# Altium schematic sheet XTIDA-010086_ADC_Temp.SchDoc
size 558 x 431 mm; Date: Not shown in title block; ApprovedBy: Not shown in title block; CheckedBy: Not shown in title block; Author: Not shown in title block; CompanyName: Not shown in title block; Engineer: Not shown in title block; Organization: Not shown in title block; Address1: Not shown in title block; Address2: Not shown in title block; Address3: Not shown in title block; Address4: Not shown in title block; DocumentNumber: 2; Revision: Use project parameter SCH_Rev; SheetNumber: 5; SheetTotal: 8; PageSetup: Record=PageOptions|CenterHorizontal=True|CenterVertical=True|PrintScale=1.00|XCorrection=1.00|YCorrection=1.00|PrintKind=0|BorderSize=5000000|LeftOffset=0|BottomOffset=0|Orientation=2|PaperLength=1000|PaperWidth=1000|Scale=100|PaperSource=15|PrintQuality=600|MediaType=1|DitherType=10|PaperKind=Letter|PrintScaleMode=1; CurrentTime: Not shown in title block; CurrentDate: Not shown in title block; Time: Not shown in title block; DocumentFullPathAndName: Not shown in title block; DocumentName: Not shown in title block; ModifiedDate: Not shown in title block; ImagePath: Not shown in title block
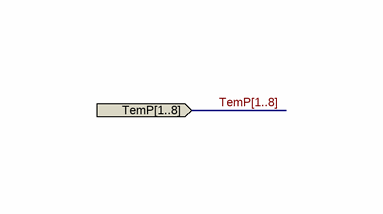
[diagram p0: XTIDA-010086_ADC_Temp.SchDoc, top left]
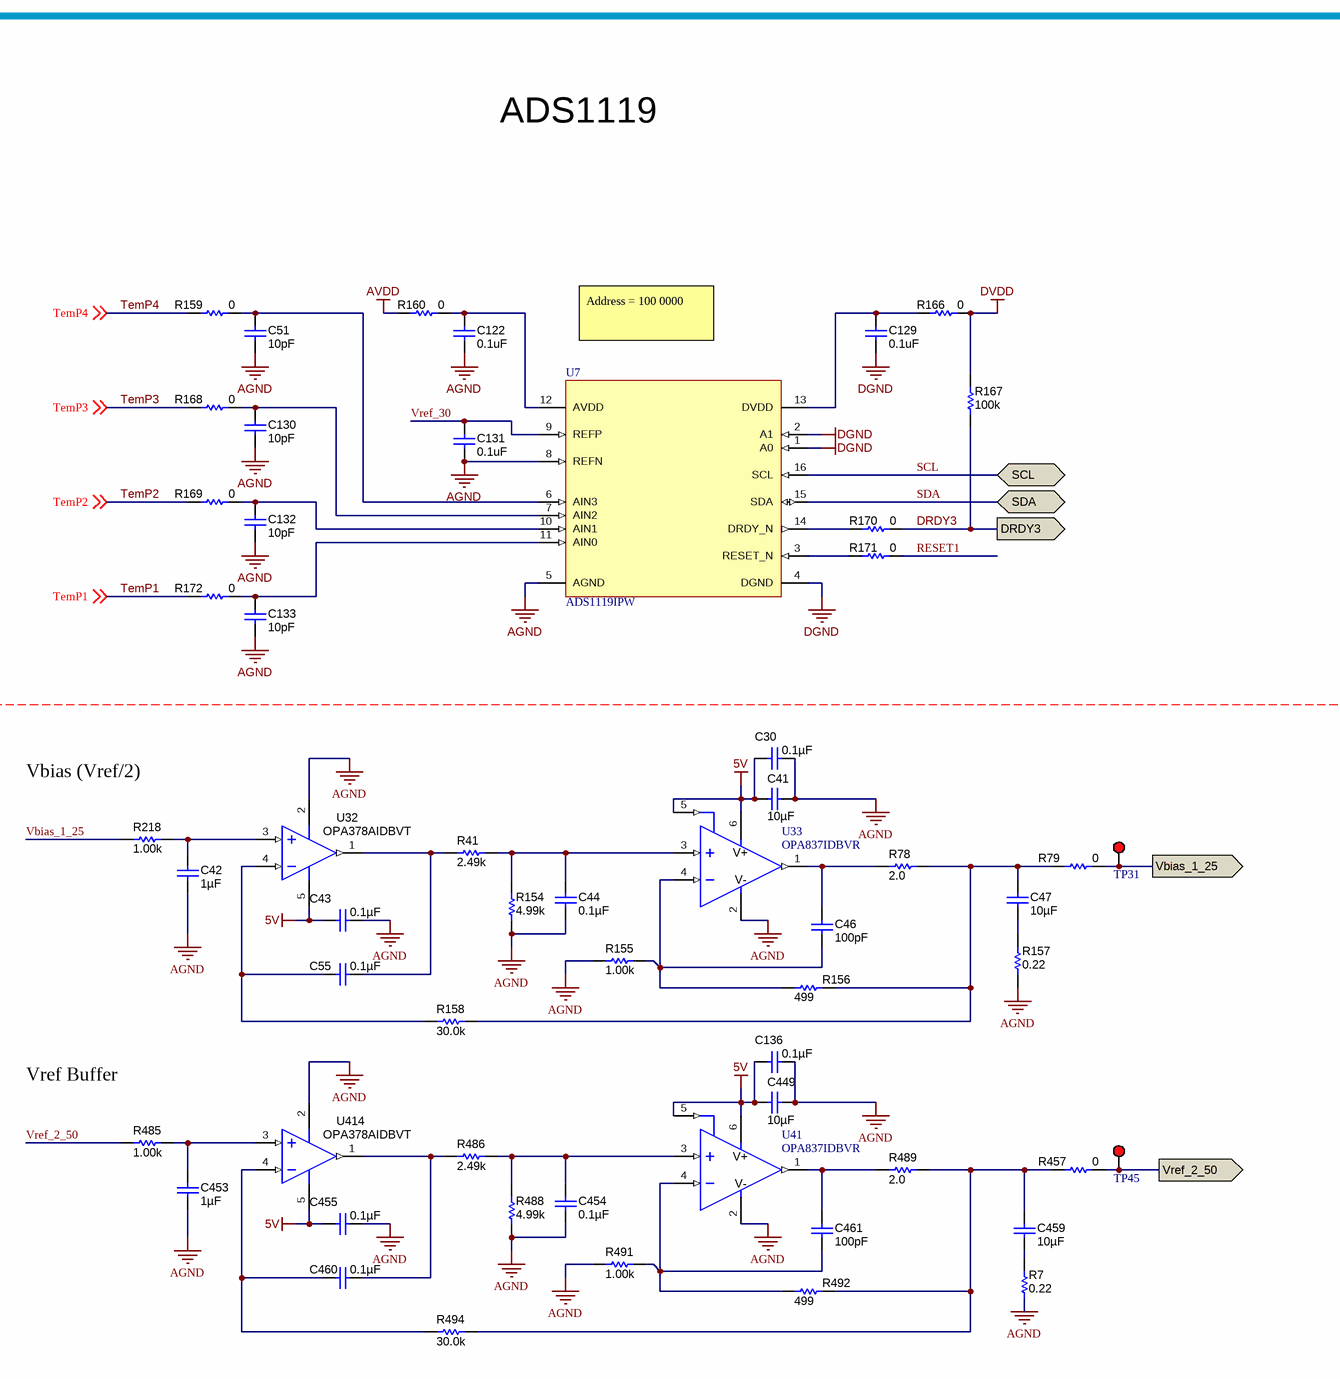
[diagram p1: XTIDA-010086_ADC_Temp.SchDoc, top right]
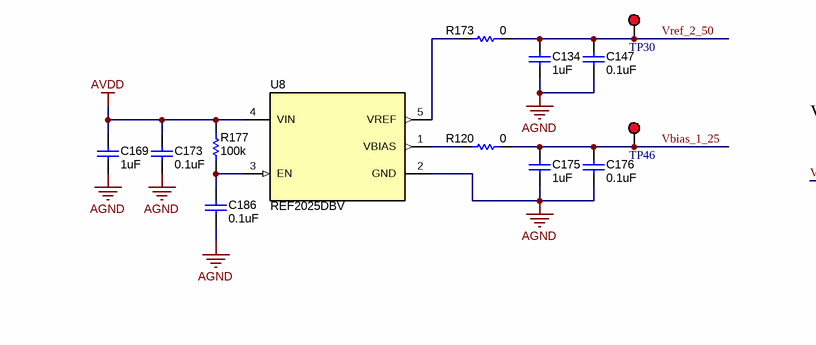
[diagram p2: XTIDA-010086_ADC_Temp.SchDoc, bottom left]
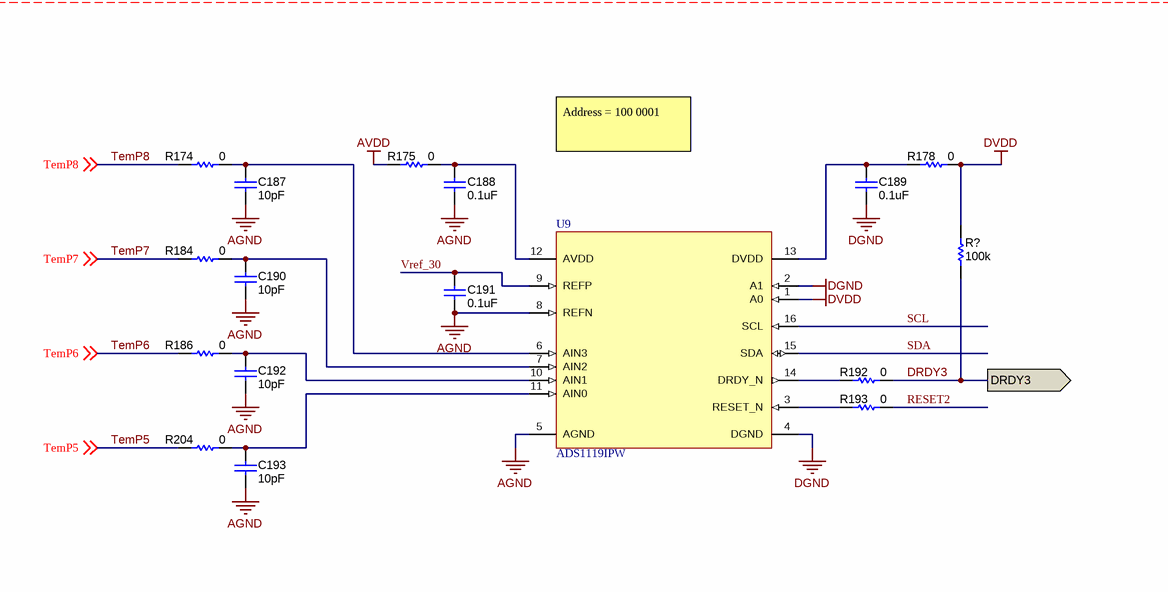
[diagram p3: XTIDA-010086_ADC_Temp.SchDoc, bottom right]

## Parts
C30  ValueDisplayed: 0.1µF  [0603]  (hidden comment: C0603C104J3RACTU)
C41  ValueDisplayed: 10µF  [0603L]  (hidden comment: ZRB18AD71A106KE01L)
C42  ValueDisplayed: 1µF  [0603]  (hidden comment: GRM188R71E105KA12D)
C43  ValueDisplayed: 0.1µF  [0603]  (hidden comment: C0603C104J3RACTU)
C44  ValueDisplayed: 0.1µF  [0603]  (hidden comment: C0603C104J3RACTU)
C46  ValueDisplayed: 100pF  [0603]  (hidden comment: 06035A101JAT2A)
C47  ValueDisplayed: 10µF  [0603L]  (hidden comment: ZRB18AD71A106KE01L)
C51  ValueDisplayed: 10pF  [0402]  (hidden comment: CGA2B2C0G1H100D050BA)
C55  ValueDisplayed: 0.1µF  [0603]  (hidden comment: C0603C104J3RACTU)
C122  ValueDisplayed: 0.1uF  [0603]  (hidden comment: Capacitor)
C129  ValueDisplayed: 0.1uF  [0603]  (hidden comment: Capacitor)
C130  ValueDisplayed: 10pF  [0402]  (hidden comment: CGA2B2C0G1H100D050BA)
C131  ValueDisplayed: 0.1uF  [0603]  (hidden comment: Capacitor)
C132  ValueDisplayed: 10pF  [0402]  (hidden comment: CGA2B2C0G1H100D050BA)
C133  ValueDisplayed: 10pF  [0402]  (hidden comment: CGA2B2C0G1H100D050BA)
C134  ValueDisplayed: 1uF  [0603]  (hidden comment: Capacitor)
C136  ValueDisplayed: 0.1µF  [0603]  (hidden comment: C0603C104J3RACTU)
C147  ValueDisplayed: 0.1uF  [0603]  (hidden comment: Capacitor)
C169  ValueDisplayed: 1uF  [0603]  (hidden comment: Capacitor)
C173  ValueDisplayed: 0.1uF  [0603]  (hidden comment: Capacitor)
C175  ValueDisplayed: 1uF  [0603]  (hidden comment: Capacitor)
C176  ValueDisplayed: 0.1uF  [0603]  (hidden comment: Capacitor)
C186  ValueDisplayed: 0.1uF  [0603]  (hidden comment: Capacitor)
C187  ValueDisplayed: 10pF  [0402]  (hidden comment: CGA2B2C0G1H100D050BA)
C188  ValueDisplayed: 0.1uF  [0603]  (hidden comment: Capacitor)
C189  ValueDisplayed: 0.1uF  [0603]  (hidden comment: Capacitor)
C190  ValueDisplayed: 10pF  [0402]  (hidden comment: CGA2B2C0G1H100D050BA)
C191  ValueDisplayed: 0.1uF  [0603]  (hidden comment: Capacitor)
C192  ValueDisplayed: 10pF  [0402]  (hidden comment: CGA2B2C0G1H100D050BA)
C193  ValueDisplayed: 10pF  [0402]  (hidden comment: CGA2B2C0G1H100D050BA)
C449  ValueDisplayed: 10µF  [0603L]  (hidden comment: ZRB18AD71A106KE01L)
C453  ValueDisplayed: 1µF  [0603]  (hidden comment: GRM188R71E105KA12D)
C454  ValueDisplayed: 0.1µF  [0603]  (hidden comment: C0603C104J3RACTU)
C455  ValueDisplayed: 0.1µF  [0603]  (hidden comment: C0603C104J3RACTU)
C459  ValueDisplayed: 10µF  [0603L]  (hidden comment: ZRB18AD71A106KE01L)
C460  ValueDisplayed: 0.1µF  [0603]  (hidden comment: C0603C104J3RACTU)
C461  ValueDisplayed: 100pF  [0603]  (hidden comment: 06035A101JAT2A)
R7  ValueDisplayed: 0.22  [0603]  (hidden comment: ERJ-3RQFR22V)
R41  ValueDisplayed: 2.49k  [0603]  (hidden comment: RG1608P-2491-B-T5)
R78  ValueDisplayed: 2.0  [0603]  (hidden comment: CRCW06032R00JNEA)
R79  ValueDisplayed: 0  [0402]  (hidden comment: ERJ-2GE0R00X)
R120  ValueDisplayed: 0  [0402]  (hidden comment: CRCW04020000Z0ED)
R154  ValueDisplayed: 4.99k  [0603]  (hidden comment: RG1608P-4991-B-T5)
R155  ValueDisplayed: 1.00k  [0603]  (hidden comment: RG1608P-102-B-T5)
R156  ValueDisplayed: 499  [0603]  (hidden comment: RG1608P-4990-B-T5)
R157  ValueDisplayed: 0.22  [0603]  (hidden comment: ERJ-3RQFR22V)
R158  ValueDisplayed: 30.0k  [0603]  (hidden comment: RG1608P-303-B-T5)
R159  ValueDisplayed: 0  [0402]  (hidden comment: CRCW04020000Z0ED)
R160  ValueDisplayed: 0  [0402]  (hidden comment: CRCW04020000Z0ED)
R166  ValueDisplayed: 0  [0402]  (hidden comment: CRCW04020000Z0ED)
R167  ValueDisplayed: 100k  [0603]  (hidden comment: RC0603FR-07100KL)
R168  ValueDisplayed: 0  [0402]  (hidden comment: CRCW04020000Z0ED)
R169  ValueDisplayed: 0  [0402]  (hidden comment: CRCW04020000Z0ED)
R170  ValueDisplayed: 0  [0402]  (hidden comment: CRCW04020000Z0ED)
R171  ValueDisplayed: 0  [0402]  (hidden comment: CRCW04020000Z0ED)
R172  ValueDisplayed: 0  [0402]  (hidden comment: CRCW04020000Z0ED)
R173  ValueDisplayed: 0  [0402]  (hidden comment: CRCW04020000Z0ED)
R174  ValueDisplayed: 0  [0402]  (hidden comment: CRCW04020000Z0ED)
R175  ValueDisplayed: 0  [0402]  (hidden comment: CRCW04020000Z0ED)
R177  ValueDisplayed: 100k  [0603]  (hidden comment: RC0603FR-07100KL)
R178  ValueDisplayed: 0  [0402]  (hidden comment: CRCW04020000Z0ED)
R184  ValueDisplayed: 0  [0402]  (hidden comment: CRCW04020000Z0ED)
R186  ValueDisplayed: 0  [0402]  (hidden comment: CRCW04020000Z0ED)
R192  ValueDisplayed: 0  [0402]  (hidden comment: CRCW04020000Z0ED)
R193  ValueDisplayed: 0  [0402]  (hidden comment: CRCW04020000Z0ED)
R204  ValueDisplayed: 0  [0402]  (hidden comment: CRCW04020000Z0ED)
R218  ValueDisplayed: 1.00k  [0603]  (hidden comment: RG1608P-102-B-T5)
R457  ValueDisplayed: 0  [0402]  (hidden comment: ERJ-2GE0R00X)
R485  ValueDisplayed: 1.00k  [0603]  (hidden comment: RG1608P-102-B-T5)
R486  ValueDisplayed: 2.49k  [0603]  (hidden comment: RG1608P-2491-B-T5)
R488  ValueDisplayed: 4.99k  [0603]  (hidden comment: RG1608P-4991-B-T5)
R489  ValueDisplayed: 2.0  [0603]  (hidden comment: CRCW06032R00JNEA)
R491  ValueDisplayed: 1.00k  [0603]  (hidden comment: RG1608P-102-B-T5)
R492  ValueDisplayed: 499  [0603]  (hidden comment: RG1608P-4990-B-T5)
R494  ValueDisplayed: 30.0k  [0603]  (hidden comment: RG1608P-303-B-T5)
R?  ValueDisplayed: 100k  [0603]  (hidden comment: RC0603FR-07100KL)
TP30  5000  [Keystone5000]  (value not drawn)
TP31  5000  [Keystone5000]  (value not drawn)
TP45  5000  [Keystone5000]  (value not drawn)
TP46  5000  [Keystone5000]  (value not drawn)
U7  ADS1119IPW  [PW0016A_M]
U8  REF2025DBV  [DBV0005A_N]
U9  ADS1119IPW  [PW0016A_M]
U32  OPA378AIDBVT  [DBV0005A_N]
U33  OPA837IDBVR  [DBV6_TEX]
U41  OPA837IDBVR  [DBV6_TEX]
U414  OPA378AIDBVT  [DBV0005A_N]

## Ports
DRDY3 (out), SCL (bidir), SDA (bidir), TemP[1..8] (in), Vbias_1_25 (out), Vref_2_50 (out)

## Nets
5V: C30.2 C41.2 C43.2 C136.2 C449.2 C455.2 U32.5(V+) U33.5(MODE) U33.6(V+) U41.5(MODE) U41.6(V+) U414.5(V+)
AGND: C30.1 C41.1 C42.2 C43.1 C44.2 C51.2 C122.2 C130.2 C131.2 C132.2 C133.2 C134.2 C136.1 C147.2 C169.2 C173.2 C175.2 C176.2 C186.2 C187.2 C188.2 C190.2 C191.2 C192.2 C193.2 C449.1 C453.2 C454.2 C455.1 R7.1 R154.1 R155.1 R157.1 R488.1 R491.1 U7.5(AGND) U7.8(REFN) U8.2(GND) U9.5(AGND) U9.8(REFN) U32.2(V-) U33.2(V-) U41.2(V-) U414.2(V-)
AVDD: C169.1 C173.1 R160.1 R175.1 R177.2 U8.4(VIN)
DGND: C129.2 C189.2 U7.1(A0) U7.2(A1) U7.4(DGND) U9.2(A1) U9.4(DGND)
DVDD: R166.2 R167.2 R178.2 R?.2 U9.1(A0)
DRDY3: R167.1 R170.2 R192.2 R?.1 ; port DRDY3
RESET1: R171.2
RESET2: R193.2
SCL: U7.16(SCL) U9.16(SCL) ; port SCL
SDA: U7.15(SDA) U9.15(SDA) ; port SDA
TemP1: R172.1 ; off-sheet TemP1
TemP2: R169.1 ; off-sheet TemP2
TemP3: R168.1 ; off-sheet TemP3
TemP4: R159.1 ; off-sheet TemP4
TemP5: R204.1 ; off-sheet TemP5
TemP6: R186.1 ; off-sheet TemP6
TemP7: R184.1 ; off-sheet TemP7
TemP8: R174.1 ; off-sheet TemP8
Vbias_1_25: C175.1 C176.1 R120.2 R218.1 TP46.1
Vbias_1_25: R79.2 TP31.1 ; port Vbias_1_25  [a separate net that carries the same name]
Vref_2_50: C134.1 C147.1 R173.2 R485.1 TP30.1
Vref_2_50: R457.2 TP45.1 ; port Vref_2_50  [a separate net that carries the same name]
Vref_30: C131.1 C191.1 U7.9(REFP) U9.9(REFP)
NetC42_1: C42.1 R218.2 U32.3(IN+)
NetC44_1: C44.1 R41.2 R154.2 U33.3(IN+)
NetC46_1: C46.1 R78.1 U33.1(OUT)
NetC46_2: C46.2 R155.2 R156.1 U33.4(IN-)
NetC47_1: C47.1 R78.2 R79.1 R156.2 R158.2
NetC47_2: C47.2 R157.2
NetC51_1: C51.1 R159.2 U7.6(AIN3)
NetC55_1: C55.1 R41.1 U32.1(OUT)
NetC55_2: C55.2 R158.1 U32.4(IN-)
NetC122_1: C122.1 R160.2 U7.12(AVDD)
NetC129_1: C129.1 R166.1 U7.13(DVDD)
NetC130_1: C130.1 R168.2 U7.7(AIN2)
NetC132_1: C132.1 R169.2 U7.10(AIN1)
NetC133_1: C133.1 R172.2 U7.11(AIN0)
NetC186_1: C186.1 R177.1 U8.3(EN)
NetC187_1: C187.1 R174.2 U9.6(AIN3)
NetC188_1: C188.1 R175.2 U9.12(AVDD)
NetC189_1: C189.1 R178.1 U9.13(DVDD)
NetC190_1: C190.1 R184.2 U9.7(AIN2)
NetC192_1: C192.1 R186.2 U9.10(AIN1)
NetC193_1: C193.1 R204.2 U9.11(AIN0)
NetC453_1: C453.1 R485.2 U414.3(IN+)
NetC454_1: C454.1 R486.2 R488.2 U41.3(IN+)
NetC459_1: C459.1 R457.1 R489.2 R492.2 R494.2
NetC459_2: C459.2 R7.2
NetC460_1: C460.1 R486.1 U414.1(OUT)
NetC460_2: C460.2 R494.1 U414.4(IN-)
NetC461_1: C461.1 R489.1 U41.1(OUT)
NetC461_2: C461.2 R491.2 R492.1 U41.4(IN-)
NetR120_1: R120.1 U8.1(VBIAS)
NetR170_1: R170.1 U7.14(DRDY_N)
NetR171_1: R171.1 U7.3(RESET_N)
NetR173_1: R173.1 U8.5(VREF)
NetR192_1: R192.1 U9.14(DRDY_N)
NetR193_1: R193.1 U9.3(RESET_N)

## Buses and harness runs
bus TemP[1..8] = port TemP[1..8]

## Layout directives
net class Vref: 5V, AGND, AVDD, Vbias_1_25, Vref_2_50

## Notes on the sheet
- ADS1119
- Address = 100 0000
- Vbias (Vref/2)
- Vref Buffer
- Address = 100 0001
- Drawn By:
- SVN Rev:
- Number:
- TID #:
- Orderable:
- Rev:
- Sheet Title:
- File:
- Project Title:
- Designed for:
- Assembly Variant:
- Mod. Date:
- Sheet:
- Size:
- of
- C
- http://www.ti.com
- Texas Instruments and/or its licensors do not warrant the accuracy or completeness of this specification or any information contained therein. Texas Instruments and/or its licensors do not warrant that this design will meet the specifications, will be suitable for your application or fit for any particular purpose, or will operate in an implementation. Texas Instruments and/or its licensors do not warrant that the design is production worthy. You should completely validate and test your design implementation to confirm the system functionality for your application.
- Engineer:
- Contact:
- © Texas Instruments

## Library data of the parts
C30 C43 C44 C55 C136 C454 C455 C460 = C0603C104J3RACTU: CAP, CERM, 0.1 µF, 25 V, +/- 5%, X7R, 0603; Manufacturer: Kemet; Polarized: N; CompType: Capacitor; Value: 0.1uF; U/M: EA; Cap_F: 0.0000001; Tolerance_%: 5; Value1: Unknown; VDC_V: 25; Value2: 25V; TaMin_C: -55; TaMax_C: 125; SymbolVersion: 2008-07-09; PartNumber: C0603C104J3RACTU; PackageReference: 0603; RoHS: Y; MountType: SMT; Technology: Ceramic; TempCo: X7R; Cap_Case: 0603; Published: 2008-06-19; Publisher: Texas Instruments; LatestRevisionDate: 2015-07-09; ComponentLink1Description: Datasheet link; ComponentLink1URL: http://www.kemet.com/kemet/web/homepage/kechome.nsf/vapubfiles/F3102_Y5V.pdf/$file/F3102_Y5V.pdf; Supplier 1: Digi-Key; Supplier Part Number 1: 399-1282-1-ND; Supplier 2: Mouser; Supplier Part Number 2: 80-C0603C104J3R; Supplier 3: Farnell; Supplier Part Number 3: 1650833
C41 C47 C449 C459 = ZRB18AD71A106KE01L: CAP, CERM, 10 µF, 10 V, +/- 10%, X7T, 0603; Manufacturer: MuRata; Polarized: N; CompType: Capacitor; Value: 10uF; U/M: EA; Cap_F: 0.00001; Tolerance_%: 10; Value1: Unknown; Value2: 10V; TaMin_C: -55; TaMax_C: 125; Cap_Case: 0603; AEC Category: Q200; SymbolVersion: 2008-07-09; PartNumber: ZRB18AD71A106KE01L; PackageReference: 0603; RoHS: Y; VDC_V: 10; MountType: SMT; Technology: Ceramic; TempCo: X7T; Published: 2008-06-19; Publisher: Texas Instruments; LatestRevisionDate: 2015-11-13; ComponentLink1Description: Datasheet link; ComponentLink1URL: http://search.murata.co.jp/Ceramy/image/img/A01X/G101/ENG/ZRB18AD71A106KE01-01.pdf; Supplier 1: Digi-Key; Supplier Part Number 1: 490-10987-1-ND; Supplier 2: Mouser; Supplier Part Number 2: 81-ZRB18AD71A106KE1L; AEC Qualified: N; AEC Grade: N/A
C42 C453 = GRM188R71E105KA12D: CAP, CERM, 1 µF, 25 V, +/- 10%, X7R, 0603; Manufacturer: MuRata; Polarized: N; CompType: Capacitor; Value: 1uF; U/M: EA; Cap_F: 0.000001; Tolerance_%: 10; Value1: Unknown; VDC_V: 25; Value2: 25V; TaMin_C: -55; TaMax_C: 125; SymbolVersion: 2008-07-09; PartNumber: GRM188R71E105KA12D; PackageReference: 0603; RoHS: Y; MountType: SMT; Technology: Ceramic; TempCo: X7R; Cap_Case: 0603; Published: 2008-06-19; Publisher: Texas Instruments; LatestRevisionDate: 2015-07-09; ComponentLink1Description: Datasheet link; ComponentLink1URL: http://search.murata.co.jp/Ceramy/PnsearchViewAction.do?HnOFG=ON&HnNFG=ON&SEL_CNT=50&sLang=en&sKey=GRM188R71E105KA12D&x=9&y=9&search=startwith; Supplier 1: Digi-Key; Supplier Part Number 1: 490-5307-1-ND; Supplier 2: Mouser; Supplier Part Number 2: 81-GRM188R71E105KA2D; Supplier 3: Farnell; Supplier Part Number 3: 1735540
C46 C461 = 06035A101JAT2A: CAP, CERM, 100 pF, 50 V, +/- 5%, C0G/NP0, 0603; Manufacturer: AVX; Polarized: N; CompType: Capacitor; Value: 100pF; U/M: EA; Cap_F: 0.0000000001; Tolerance_%: 5; ESR_ohm: 0.119; Value1: 0.119 ohm; VDC_V: 50; Value2: 50V; TaMin_C: -55; TaMax_C: 125; SizeArea_mm2: 1.28; SizeAreaWB_mm2: 4.68; SizeX_mm: 1.6; SizeY_mm: 0.8; SizeZ_mm: 1; AEC Category: Q200; SymbolVersion: 2008-07-09; PartNumber: 06035A101JAT2A; PackageReference: 0603; RoHS: Y; MountType: SMT; Technology: Ceramic; TempCo: C0G/NP0; Cap_Case: 0603; Published: 2008-06-19; Publisher: Texas Instruments; LatestRevisionDate: 2017-03-03; ComponentLink1Description: Datasheet link; ComponentLink1URL: http://datasheets.avx.com/C0GNP0-Dielectric.pdf; Supplier 1: Digi-Key; Supplier Part Number 1: 478-1175-1-ND; Supplier 2: Newark; Supplier Part Number 2: 96K4763; Supplier 3: Mouser; Supplier Part Number 3: 581-06035A101J; AEC Qualified: N; AEC Grade: N/A
C51 C130 C132 C133 C187 C190 C192 C193 = CGA2B2C0G1H100D050BA: CAP, CERM, 10 pF, 50 V,+/- 5%, C0G/NP0, AEC-Q200 Grade 1, 0402; Manufacturer: TDK; Polarized: N; CompType: Capacitor; Value: 10pF; U/M: EA; Cap_F: 0.00000000001; Tolerance_%: 5; VDC_V: 50; Value2: 50V; TaMin_C: -55; TaMax_C: 125; SizeArea_mm2: 0.5; SizeAreaWB_mm2: 3; SizeX_mm: 1; SizeZ_mm: 0.6; AEC Category: Q200; AEC Qualified: Y; SymbolVersion: 2008-07-09; PartNumber: CGA2B2C0G1H100D050BA; PackageReference: 0402; RoHS: Y; MountType: SMT; Technology: Ceramic; TempCo: C0G/NP0; Cap_Case: 0402; SizeY_mm: 0.5; Published: 2008-06-19; Publisher: Texas Instruments; LatestRevisionDate: 2017-06-22; ComponentLink1Description: Datasheet link; ComponentLink1URL: https://product.tdk.com/info/en/documents/chara_sheet/CGA2B2C0G1H100D050BA.pdf; Supplier 1: Digi-Key; Supplier Part Number 1: 445-5584-1-ND; Supplier 2: Newark; Supplier Part Number 2: 52W9563; Supplier 3: Mouser; Supplier Part Number 3: 810-CGA2B2C0G1H100D; AEC Grade: 1
C122 C129 C131 C147 C173 C176 C186 C188 C189 C191 = Capacitor: CAP, CERM, 0.1 uF, 25 V, +/- 5%, X7R, 0603; PartNumber: 06033C104JAT2A; Manufacturer: AVX; Polarized: N; Value: 0.1uF; U/M: EA; Cap_F: 100nF; ESR_ohm: 0.05; Value1: 0.05 ohm; VDC_V: 25V; TaMin_C: -55°C; TaMax_C: 125°C; AEC Category: Q200; SizeArea_mm2: 1.28; SizeAreaWB_mm2: 4.68; SizeX_mm: 1.6; SizeY_mm: 0.8; SizeZ_mm: 1; CompType: Capacitor; PackageReference: 0603; RoHS: Y; Tolerance_%: 5%; Value2: 25V; MountType: SMT; Technology: Ceramic; TempCo: X7R; Cap_Case: 0603; Published: 2008-06-19; Publisher: Texas Instruments; LatestRevisionDate: 2017-03-09; ComponentLink1Description: Datasheet link; ComponentLink1URL: http://datasheets.avx.com/X7RDielectric.pdf; Supplier 1: Digi-Key; Supplier Part Number 1: 478-3713-1-ND; Supplier 2: Mouser; Supplier Part Number 2: 581-06033C104JAT2A; Supplier 3: Farnell; Supplier Part Number 3: 1740614; AEC Qualified: N; AEC Grade: N/A
C134 C169 C175 = Capacitor: CAP, CERM, 1 uF, 25 V, +/- 10%, X7R, 0603; PartNumber: GRM188R71E105KA12D; Manufacturer: MuRata; Polarized: N; Value: 1uF; U/M: EA; Cap_F: 1µF; Value1: Unknown; VDC_V: 25V; TaMin_C: -55°C; TaMax_C: 125°C; AEC Category: Q200; SizeArea_mm2: 1.28; SizeAreaWB_mm2: 4.68; SizeX_mm: 1.6; SizeY_mm: 0.8; SizeZ_mm: 1; CompType: Capacitor; PackageReference: 0603; RoHS: Y; Tolerance_%: 10%; Value2: 25V; MountType: SMT; Technology: Ceramic; TempCo: X7R; Cap_Case: 0603; Published: 2008-06-19; Publisher: Texas Instruments; LatestRevisionDate: 2017-03-09; ComponentLink1Description: Datasheet link; ComponentLink1URL: http://search.murata.co.jp/Ceramy/PnsearchViewAction.do?HnOFG=ON&HnNFG=ON&SEL_CNT=50&sLang=en&sKey=GRM188R71E105KA12D&x=9&y=9&search=startwith; Supplier 1: Digi-Key; Supplier Part Number 1: 490-5307-1-ND; Supplier 2: Mouser; Supplier Part Number 2: 81-GRM188R71E105KA2D; Supplier 3: Farnell; Supplier Part Number 3: 1735540; AEC Qualified: ?
R7 R157 = ERJ-3RQFR22V: RES, 0.22, 1%, 0.1 W, 0603; Manufacturer: Panasonic; CompType: Resistor; Value: 0.22; Value_Code: R220; Tolerance_%: 1; Power_W: 0.1; Value2: 0.1W; TempCo: 300 ppm/C; SizeArea_mm2: 1.28; SizeX_mm: 1.6; SizeY_mm: 0.8; EIA_Code: E96; U/M: EA; AEC Category: Q200; SymbolVersion: 2009-05-29; PartNumber: ERJ-3RQFR22V; PackageReference: 0603; RoHS: Y; Res_ohm: 0.22; Value1: 1%; MountType: SMT; Technology: Thick Film; SizeZ_mm: 1; Published: 2008-06-26; Publisher: Texas Instruments; LatestRevisionDate: 2017-03-04; ComponentLink1Description: Datasheet link; ComponentLink1URL: http://www.panasonic.com/industrial/components/pdf/AOA0000CE3.pdf; Supplier 1: Digi-Key; Supplier Part Number 1: P.22AJCT-ND; Supplier 2: Newark; Supplier Part Number 2: 15R1425; Supplier 3: Mouser; Supplier Part Number 3: 667-ERJ-3RQFR22V; AEC Qualified: ?
R41 R486 = RG1608P-2491-B-T5: RES, 2.49 k, 0.1%, 0.1 W, 0603; Manufacturer: Susumu Co Ltd; CompType: Resistor; Value: 2.49k; Res_ohm: 2490; Value_Code: 2k49; Tolerance_%: 0.1; Value2: 0.1W; VDC_V: 75; TempCo: 25 ppm/C; EIA_Code: E192; U/M: EA; SymbolVersion: 2009-05-29; PartNumber: RG1608P-2491-B-T5; PackageReference: 0603; RoHS: Y; Value1: 0.1%; Power_W: 0.1; MountType: SMT; Technology: Metal Film; Published: 2008-06-26; Publisher: Texas Instruments; LatestRevisionDate: 2015-06-13; ComponentLink1Description: Datasheet link; ComponentLink1URL: http://www.susumu.co.jp/english/pdf/products-j01-01.pdf; Supplier 1: Digi-Key; Supplier Part Number 1: RG16P2.49KBCT-ND; Supplier 2: Mouser; Supplier Part Number 2: 754-RG1608P-2491-BT5; Supplier 3: Farnell; Supplier Part Number 3: 1797138
R78 R489 = CRCW06032R00JNEA: RES, 2.0, 5%, 0.1 W, 0603; Manufacturer: Vishay-Dale; CompType: Resistor; Value: 2.0; Res_ohm: 2; Value_Code: 2R00; Tolerance_%: 5; Power_W: 0.1; Value2: 0.1W; VDC_V: 75; TempCo: 200 ppm/C; SizeArea_mm2: 1.28; SizeX_mm: 1.6; SizeY_mm: 0.8; SizeZ_mm: 1; EIA_Code: E24; U/M: EA; AEC Category: Q200; SymbolVersion: 2009-05-29; PartNumber: CRCW06032R00JNEA; PackageReference: 0603; RoHS: Y; Value1: 5%; MountType: SMT; Technology: Thick Film; Published: 2008-06-26; Publisher: Texas Instruments; LatestRevisionDate: 2017-03-04; ComponentLink1Description: Datasheet link; ComponentLink1URL: http://www.vishay.com/docs/20035/dcrcwe3.pdf; Supplier 1: Digi-Key; Supplier Part Number 1: 541-2.0GCT-ND; Supplier 2: Mouser; Supplier Part Number 2: 71-CRCW0603J-2-E3; Supplier 3: Farnell; Supplier Part Number 3: 1889800; AEC Qualified: ?
R79 R457 = ERJ-2GE0R00X: RES, 0, 5%, 0.063 W, 0402; Manufacturer: Panasonic; CompType: Resistor; Value: 0; Value_Code: 0000; Tolerance_%: 5; Power_W: 0.063; Value2: 0.063W; VDC_V: 50; TempCo: 600 ppm/C; EIA_Code: E24; U/M: EA; AEC Category: Q200; SymbolVersion: 2009-05-29; PartNumber: ERJ-2GE0R00X; PackageReference: 0402; RoHS: Y; Res_ohm: 0; Value1: 5%; MountType: SMT; Technology: Thick Film; Published: 2008-06-26; Publisher: Texas Instruments; LatestRevisionDate: 2015-10-23; ComponentLink1Description: Datasheet link; ComponentLink1URL: http://www.panasonic.com/industrial/components/pdf/AOA0000CE1.pdf; Supplier 1: Digi-Key; Supplier Part Number 1: P0.0JCT-ND; Supplier 2: Mouser; Supplier Part Number 2: 667-ERJ-2GE0R00X; Supplier 3: Farnell; Supplier Part Number 3: 2059190; AEC Qualified: ?
R120 R159 R160 R166 R168-R175 R178 R184 R186 R192 R193 R204 = CRCW04020000Z0ED: RES, 0, 5%, 0.063 W, 0402; Manufacturer: Vishay-Dale; CompType: Resistor; Value: 0; Value_Code: 0000; Tolerance_%: 5; Power_W: 0.063; Value2: 0.063W; VDC_V: 50; TempCo: 200 ppm/C; SizeArea_mm2: 0.5; SizeX_mm: 1; SizeZ_mm: 0.6; EIA_Code: E24; U/M: EA; AEC Category: Q200; Green_Lifecycle: Active; Green_REACh: Passed; SymbolVersion: 2009-05-29; PartNumber: CRCW04020000Z0ED; PackageReference: 0402; RoHS: Y; Res_ohm: 0; Value1: 5%; MountType: SMT; Technology: Thick Film; SizeY_mm: 0.5; Published: 2008-06-26; Publisher: Texas Instruments; LatestRevisionDate: 2017-06-12; ComponentLink1Description: Datasheet link; ComponentLink1URL: http://www.vishay.com/docs/20035/dcrcwe3.pdf; Supplier 1: Digi-Key; Supplier Part Number 1: 541-0.0JCT-ND; Supplier 2: Newark; Supplier Part Number 2: 52K6543; Supplier 3: Mouser; Supplier Part Number 3: 71-CRCW0402-0-E3; AEC Qualified: ?; Green_EU RoHS: Passed with Exemption; Green_EU RoHS-2: Passed
R154 R488 = RG1608P-4991-B-T5: RES, 4.99 k, 0.1%, 0.1 W, 0603; Manufacturer: Susumu Co Ltd; CompType: Resistor; Value: 4.99k; Res_ohm: 4990; Value_Code: 4k99; Tolerance_%: 0.1; Value2: 0.1W; VDC_V: 75; TempCo: 25 ppm/C; EIA_Code: E192; U/M: EA; SymbolVersion: 2009-05-29; PartNumber: RG1608P-4991-B-T5; PackageReference: 0603; RoHS: Y; Value1: 0.1%; Power_W: 0.1; MountType: SMT; Technology: Metal Film; Published: 2008-06-26; Publisher: Texas Instruments; LatestRevisionDate: 2015-06-13; ComponentLink1Description: Datasheet link; ComponentLink1URL: http://www.susumu.co.jp/english/pdf/products-j01-01.pdf; Supplier 1: Digi-Key; Supplier Part Number 1: RG16P4.99KBCT-ND; Supplier 2: Mouser; Supplier Part Number 2: 754-RG1608P-4991-BT5
R155 R218 R485 R491 = RG1608P-102-B-T5: RES, 1.00 k, 0.1%, 0.1 W, 0603; Manufacturer: Susumu Co Ltd; CompType: Resistor; Value: 1.00k; Res_ohm: 1000; Value_Code: 1k00; Tolerance_%: 0.1; Value2: 0.1W; VDC_V: 75; TempCo: 25 ppm/C; EIA_Code: E192; U/M: EA; SymbolVersion: 2009-05-29; PartNumber: RG1608P-102-B-T5; PackageReference: 0603; RoHS: Y; Value1: 0.1%; Power_W: 0.1; MountType: SMT; Technology: Metal Film; Published: 2008-06-26; Publisher: Texas Instruments; LatestRevisionDate: 2015-06-13; ComponentLink1Description: Datasheet link; ComponentLink1URL: http://www.susumu.co.jp/english/pdf/products-j01-01.pdf; Supplier 1: Digi-Key; Supplier Part Number 1: RG16P1.0KBCT-ND; Supplier 2: Mouser; Supplier Part Number 2: 754-RG1608P-102-B-T5; Supplier 3: Farnell; Supplier Part Number 3: 1797076
R156 R492 = RG1608P-4990-B-T5: RES, 499, 0.1%, 0.1 W, 0603; Manufacturer: Susumu Co Ltd; CompType: Resistor; Value: 499; Value_Code: 499R; Tolerance_%: 0.1; Value2: 0.1W; VDC_V: 75; TempCo: 25 ppm/C; EIA_Code: E192; U/M: EA; SymbolVersion: 2009-05-29; PartNumber: RG1608P-4990-B-T5; PackageReference: 0603; RoHS: Y; Res_ohm: 499; Value1: 0.1%; Power_W: 0.1; MountType: SMT; Technology: Metal Film; Published: 2008-06-26; Publisher: Texas Instruments; LatestRevisionDate: 2015-06-13; ComponentLink1Description: Datasheet link; ComponentLink1URL: http://www.susumu.co.jp/english/pdf/products-j01-01.pdf; Supplier 1: Digi-Key; Supplier Part Number 1: RG16P499BCT-ND; Supplier 2: Mouser; Supplier Part Number 2: 754-RG1608P-4990-BT5; Supplier 3: Farnell; Supplier Part Number 3: 1797198
R158 R494 = RG1608P-303-B-T5: RES, 30.0 k, 0.1%, 0.1 W, 0603; Manufacturer: Susumu Co Ltd; CompType: Resistor; Value: 30.0k; Res_ohm: 30000; Value_Code: 30k0; Tolerance_%: 0.1; Value2: 0.1W; VDC_V: 75; TempCo: 25 ppm/C; U/M: EA; AEC Category: Q200; SymbolVersion: 2009-05-29; PartNumber: RG1608P-303-B-T5; PackageReference: 0603; RoHS: Y; Value1: 0.1%; Power_W: 0.1; MountType: SMT; Technology: Metal Film; Published: 2008-06-26; Publisher: Texas Instruments; LatestRevisionDate: 2015-10-21; ComponentLink1Description: Datasheet link; ComponentLink1URL: http://www.susumu.co.jp/english/pdf/products-j01-01.pdf; Supplier 1: Digi-Key; Supplier Part Number 1: RG16P30.0KBCT-ND; Supplier 2: Mouser; Supplier Part Number 2: 754-RG1608P-303-B-T5; Supplier 3: Farnell; Supplier Part Number 3: 1797154; AEC Qualified: ?
R167 R? = Resistor: RES, 100 k, 1%, 0.1 W, 0603; Manufacturer: Yageo; Power_W: 100mW; TempCo: 100 ppm/C; Value: 100k; EIA_Code: E96; SizeX_mm: 1.6; SizeY_mm: 0.8; SizeZ_mm: 1; Value2: 0.1W; SizeArea_mm2: 1.28; AEC Qualified: N; VDC_V: 75V; AEC Category: Q200; SizeAreaWB_mm2: 4.68; Supplier Part Number 2: 603-RC0603FR-07100KL; Supplier 2: Mouser; Supplier Part Number 3: 9238727; Supplier 3: Farnell; Value_Code: 100k; RoHS: Y; Value1: 1%; MountType: SMT; Supplier 1: Digi-Key; PackageReference: 0603; Tolerance_%: 1%; Res_ohm: 100k; CompType: Resistor; PartNumber: RC0603FR-07100KL; ComponentLink1Description: Datasheet link; Supplier Part Number 1: 311-100KHRCT-ND; Technology: Thick Film; ComponentLink1URL: http://www.yageo.com/pdf/Pu-RC0603_51_PbFree_L_2.pdf; AEC Grade: N/A
R177 = CMP-0022735-5: RES, 100 k, 1%, 0.1 W, 0603; Manufacturer: Yageo; Power_W: 100mW; TempCo: 100 ppm/C; Value: 100k; EIA_Code: E96; SizeX_mm: 1.6; SizeY_mm: 0.8; SizeZ_mm: 1; Value2: 0.1W; SizeArea_mm2: 1.28; AEC Qualified: N; VDC_V: 75V; AEC Category: Q200; SizeAreaWB_mm2: 4.68; Supplier Part Number 2: 603-RC0603FR-07100KL; Supplier 2: Mouser; Supplier Part Number 3: 9238727; Supplier 3: Farnell; Value_Code: 100k; RoHS: Y; Value1: 1%; MountType: SMT; Supplier 1: Digi-Key; PackageReference: 0603; Tolerance_%: 1%; Res_ohm: 100k; CompType: Resistor; PartNumber: RC0603FR-07100KL; ComponentLink1Description: Datasheet link; Supplier Part Number 1: 311-100KHRCT-ND; Technology: Thick Film; ComponentLink1URL: http://www.yageo.com/pdf/Pu-RC0603_51_PbFree_L_2.pdf; AEC Grade: N/A
TP30 TP31 TP45 TP46 = 5000: Test Point, Miniature, Red, TH; Manufacturer: Keystone; CompType: Test Point Loop; ContactFinish: Silver; Green_Lifecycle: Active; Green_REACh: Passed; SymbolVersion: 2008-04-04; PartNumber: 5000; PackageReference: Red Miniature Testpoint; RoHS: Y; MountType: TH; ComponentLink1Description: Datasheet URL; ComponentLink1URL: http://www.keyelco.com/userAssets/file/M60-2p60.pdf; Color: Red; Publisher: Texas Instruments; LatestRevisionDate: 2017-05-11; Supplier 1: Digi-Key; Supplier Part Number 1: 36-5000-ND; Supplier 2: Mouser; Supplier Part Number 2: 534-5000; Green_EU RoHS: Passed; Green_EU RoHS-2: Incomplete
U7 U9 = ADS1119IPW: No Description Available; Manufacturer: Texas Instruments; PartNumber: ADS1119IPWR; RefDes: RefDes; Type: DEV; Value: Value; Copyright: Copyright (C) 2018 Accelerated Designs. All rights reserved
U8 = CMP-0013048-2: DUAL OUTPUT VOLTAGE REFERENCE 2.5V, DBV0005A (SOT-5); Manufacturer: Texas Instruments; SizeX_mm: 2.8; SizeY_mm: 2.9; CompType: IC; SizeZ_mm: 1.45; SizeArea_mm2: 8.12; SizeAreaWB_mm2: 14.82; U/M: EA; PackageDescription: SOT-5; PartNumber: REF2025DBV; ComponentLink1URL: https://sps06.itg.ti.com/sites/KMS/crossdivteams/altium/docs/ComponentDatasheets/REF20XX_DUAL OUTPUT .pdf; ComponentLink1Description: Datasheet Link; LatestRevisionDate: 2017-03-09; Publisher: Texas Instruments; RoHS: Y; PackageReference: DBV0005A; MountType: SMT; Alternate Manufacturer: Texas Instruments
U32 U414 = OPA378AIDBVT: Low-Noise, 900 kHz, RRIO, Precision Operational Amplifier, Zerø-Drift Series, 2.2 to 5.5 V, -40 to 125 degC, 5-pin SOT23 (DBV0005A), Green (RoHS & no Sb/Br); Manufacturer: Texas Instruments; Alternate PartNumber: Equivalent; CMRR(Min)(dB): 100; IIB(Max)(pA): 550; Iq per channel(Max)(mA): 0.15; Number of Channels: 1; Offset Drift(Typ)(uV/C): 0.1; Slew Rate(Typ)(V/us): 0.4; Sub Family: Low Input Bias Current Amp (<=10pA), Low Offset Voltage Amplifier (<=500uV), Low Power Amp (<=500uA), Low Supply Voltage Amplifier (<=2.7V), Precision Amplifier, Zero Drift Precision Amplifier; Total Supply Voltage(Max)(+5V is 5, +/-5V is 10): 5.5; Total Supply Voltage(Min)(+5V is 5, +/-5V is 10): 2.2; Vio (25C)(Max)(mV): 0.05; Vn at 1kHz(Typ)(nV/rtHz): 20; DatasheetVersion: SBOS417D; PackageVersion: 4073253-4/K, 03/2006; PackageReference: DBV0005A; PackageDescription: 5-Pin Plastic Small Outline, Body 1.6 x 2.9 mm, Pitch 0.95 mm; Supplier 1: Digi-Key; Supplier Part Number 1: 296-24619-2-ND; Supplier 2: Digi-Key; Supplier Part Number 2: 296-24619-1-ND; Supplier 3: Digi-Key; Supplier Part Number 3: 296-24619-6-ND; Supplier 4: Farnell; Supplier Part Number 4: 1735565; Supplier 5: Newark; Supplier Part Number 5: 14R7884; Supplier 6: Mouser; Supplier Part Number 6: 595-OPA378AIDBVT; Eco-Plan: Green (RoHS & no Sb/Br); MountType: SMT; Code_JEDEC: MO-178; PartNumber: OPA378AIDBVT; ComponentLink1Description: Manufacturer URL; ComponentLink1URL: http://www.ti.com/; ComponentLink2Description: Datasheet; ComponentLink2URL: http://www.ti.com/general/docs/lit/getliterature.tsp?genericPartNumber=OPA378&fileType=pdf; ComponentLink3Description: Package Specification; ComponentLink3URL: http://www.ti.com/litv/pdf/mpds018i; Alternate Manufacturer: Texas Instruments
U33 U41 = OPA837IDBVR: LOW POWER HIGH SPEED OP AMP; SourceLibrary: TI_2019-05-11; Built_By: EMA_Molly; Vendor: Texas Instruments; Slew Rate: 105V/µs; Number of Circuits: 1; Gain Bandwidth Product: 50MHz; Input Bias Current: 340nA; Input Offset Voltage (Vos): 30uV; Operating Supply Current: 592uA; Copyright: Copyright (C) 2018 Accelerated Designs. All rights reserved; Manufacturer_Part_Number: OPA837IDBVR; RefDes: RefDes; Type: DEV; Supplier 1: Digi-Key; Manufacturer: Texas Instruments; Manufacturer Part Number: OPA837IDBVR; RoHS: No; Category: Amplifiers - Op Amps, Buffer, Instrumentation; Stock 1: 491; Pricing 1: 1=2.28000, 10=2.05100, 25=1.93520, 100=1.54800, 250=1.35452, 500=1.31580, 1000=1.04490 (USD); Mount: Surface Mount; Case/Package: SOT-23-6; Min Operating Temperature: -40°C; Max Operating Temperature: 125°C; Packaging: Tape and Reel; Number of Channels: 1; ComponentLink1URL: http://www.ti.com/lit/ds/symlink/opa837.pdf?src-supplier=Digi-Key; ComponentLink1Description: http://www.ti.com/lit/ds/symlink/opa837.pdf?src-supplier=Digi-Key; Supplier Part Number 1: 296-49253-1-ND